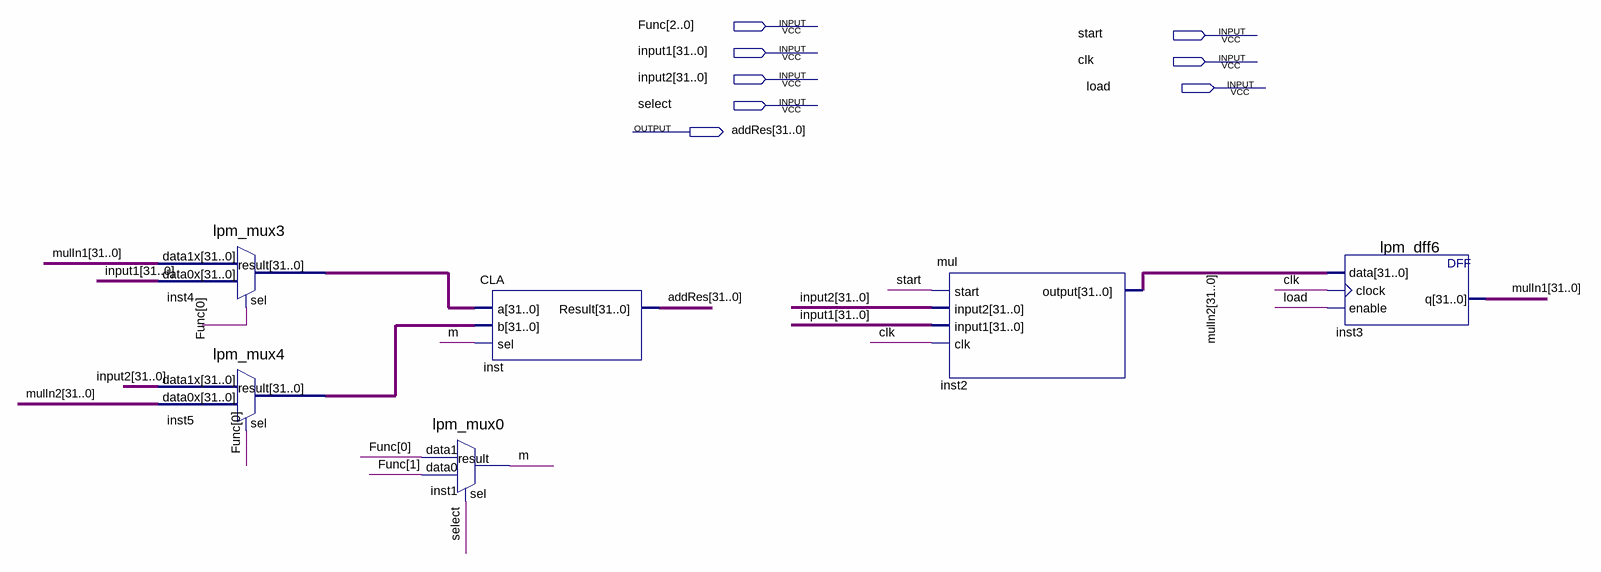
[diagram p0: schematic sheet]
// Quartus schematic ALU.bdf as structural Verilog: 6 symbols, 8 pins
module ALU (
  input  [2:0] Func,
  input  start,
  input  [31:0] input1,
  input  clk,
  input  [31:0] input2,
  input  load,
  input  select,
  output [31:0] addRes
);

  wire m;
  wire [31:0] inst4_result, inst5_result, mulIn1, mulIn2;

  lpm_mux3 inst4 (.data1x(mulIn1), .data0x(input1), .sel(Func[0]), .result(inst4_result));
  lpm_mux4 inst5 (.data1x(input2), .data0x(mulIn2), .sel(Func[0]), .result(inst5_result));
  lpm_mux0 inst1 (.data1(Func[0]), .data0(Func[1]), .sel(select), .result(m));
  CLA inst (.a(inst4_result), .b(inst5_result), .sel(m), .Result(addRes));
  mul inst2 (.start(start), .input2(input2), .input1(input1), .clk(clk), .\output (mulIn2));
  lpm_dff6 inst3 (.data(mulIn2), .clock(clk), .enable(load), .q(mulIn1));
endmodule
